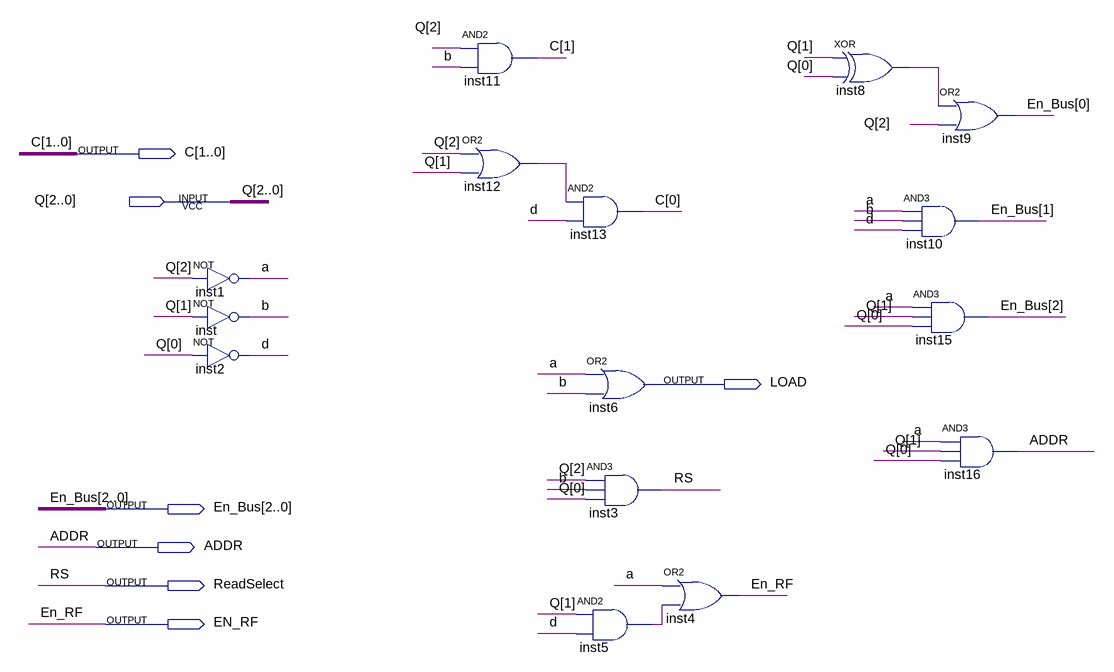
[diagram p0: schematic sheet]
// Quartus schematic Output_Logic_4.bdf as structural Verilog: 15 symbols, 7 pins
module Output_Logic_4 (
  input  [2:0] Q,
  output [1:0] C,
  output LOAD,
  output [2:0] En_Bus,
  output ADDR,
  output ReadSelect,
  output EN_RF
);

  wire a, b, d, inst5_out, inst8_out, inst12_out;

  not inst1 (a, Q[2]);
  not inst (b, Q[1]);
  not inst2 (d, Q[0]);
  and inst11 (C[1], Q[2], b);
  or inst12 (inst12_out, Q[2], Q[1]);
  and inst13 (C[0], inst12_out, d);
  or inst6 (LOAD, a, b);
  and inst3 (ReadSelect, Q[2], b, Q[0]);
  and inst5 (inst5_out, Q[1], d);
  or inst4 (EN_RF, a, inst5_out);
  xor inst8 (inst8_out, Q[1], Q[0]);
  and inst10 (En_Bus[1], a, b, d);
  and inst15 (En_Bus[2], a, Q[1], Q[0]);
  or inst9 (En_Bus[0], inst8_out, Q[2]);
  and inst16 (ADDR, a, Q[1], Q[0]);

  // Other names for the same wires on the sheet: RS = ReadSelect
endmodule
